# EAGLE design DCF77-Uhr-V4.1Big.OHW7 (EAGLE 6.4)

## Sheet 1 of 2
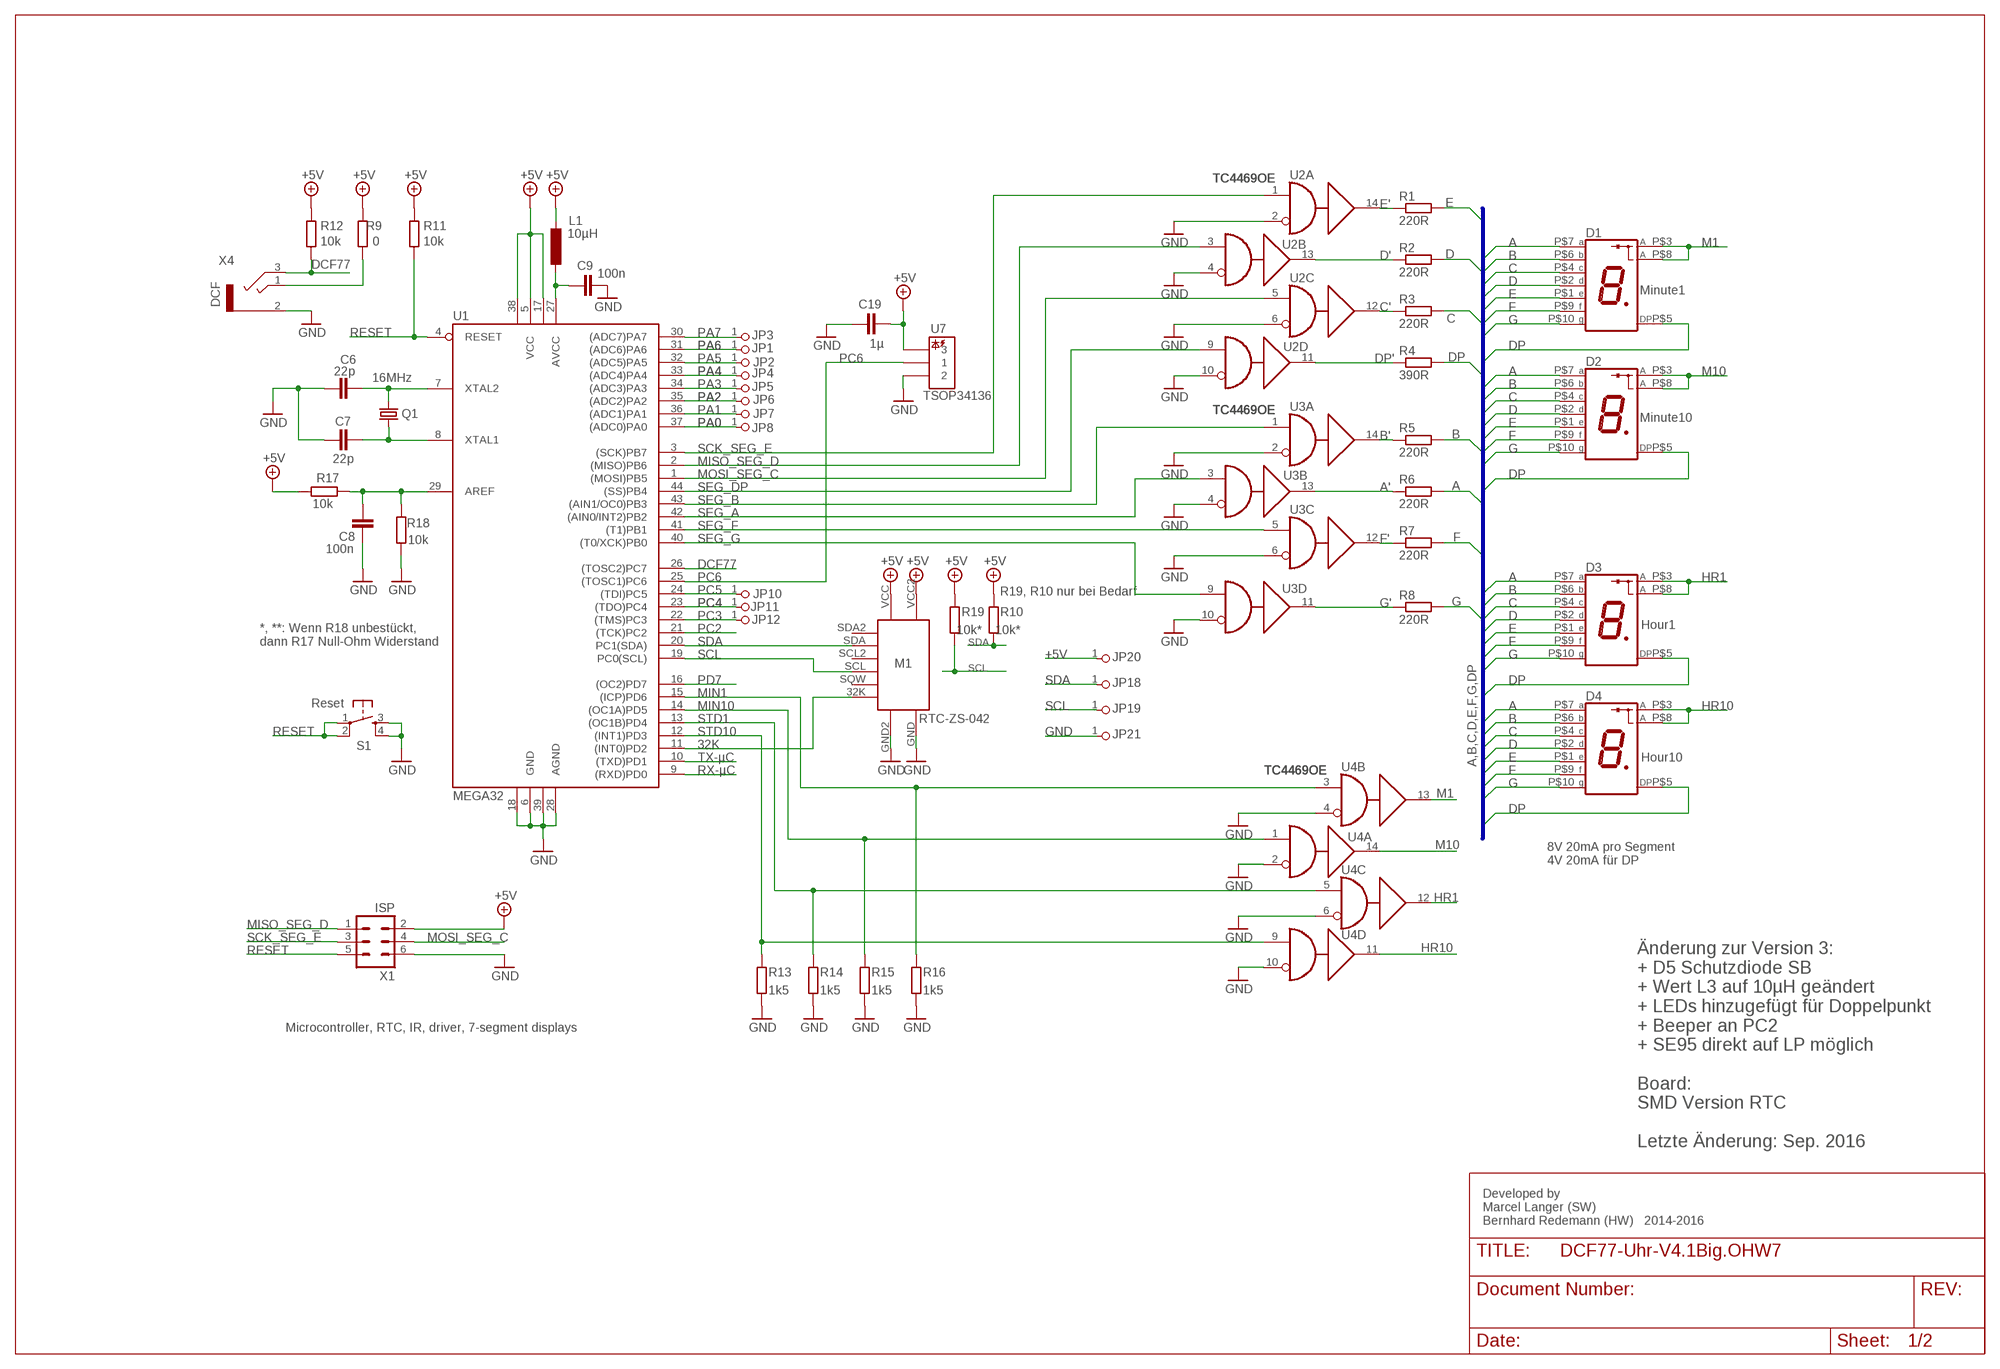
[diagram p0: schematic, sheet 1]

### Parts
C6  22p  C-EUC0805  [C0805]
C7  22p  C-EUC0805  [C0805]
C8  100n  C-EUC0805  [C0805]
C9  100n  C-EUC0805  [C0805]
C19  1µ  C-EUC0805  [C0805]
D1  Minute1  SA40-19EWA  [SA40-19EWA]
D2  Minute10  SA40-19EWA  [SA40-19EWA]
D3  Hour1  SA40-19EWA  [SA40-19EWA]
D4  Hour10  SA40-19EWA  [SA40-19EWA]
JP1  PA6  PINHD-1X1  [1X01]
JP2  PC5  PINHD-1X1  [1X01]
JP3  PA6  PINHD-1X1  [1X01]
JP4  PA4  PINHD-1X1  [1X01]
JP5  PA3  PINHD-1X1  [1X01]
JP6  PA2  PINHD-1X1  [1X01]
JP7  PA1  PINHD-1X1  [1X01]
JP8  PA0  PINHD-1X1  [1X01]
JP10  PC5  PINHD-1X1  [1X01]
JP11  PC4  PINHD-1X1  [1X01]
JP12  PC3  PINHD-1X1  [1X01]
JP18  SDA  PINHD-1X1  [1X01]
JP19  SCL  PINHD-1X1  [1X01]
JP20  +5V  PINHD-1X1  [1X01]
JP21  GND  PINHD-1X1  [1X01]
L1  10µH  L-EUL2825P  [L2825P]
M1  RTC-ZS-042  RTC-ZS-042SMD  [ZS-042-SMD]
Q1  16MHz  CRYSTALHC49UP  [HC49UP]
R1  220R  R-EU_M0805  [M0805]
R2  220R  R-EU_M0805  [M0805]
R3  220R  R-EU_M0805  [M0805]
R4  390R  R-EU_M0805  [M0805]
R5  220R  R-EU_M0805  [M0805]
R6  220R  R-EU_M0805  [M0805]
R7  220R  R-EU_M0805  [M0805]
R8  220R  R-EU_M0805  [M0805]
R9  0  R-EU_M0805  [M0805]
R10  10k*  R-EU_M0805  [M0805]
R11  10k  R-EU_M0805  [M0805]
R12  10k  R-EU_M0805  [M0805]
R13  1k5  R-EU_M0805  [M0805]
R14  1k5  R-EU_M0805  [M0805]
R15  1k5  R-EU_M0805  [M0805]
R16  1k5  R-EU_M0805  [M0805]
R17  10k  R-EU_M0805  [M0805]
R18  10k  R-EU_M0805  [M0805]
R19  10k*  R-EU_M0805  [M0805]
S1  Reset  DTSM-6  [DTSM-6]
U1  MEGA32  MEGA32-A  [TQFP44]
U2  TC4469OE  [SO-16DW]
U3  TC4469OE  [SO-16DW]
U4  TC4469OE  [SO-16DW]
U7  TSOP34136  [TSOP348]
X1  ISP  ML6  [ML6]
X4  DCF  1502_01  [1502_01]

### Nets
32K: M1.32K U1.11((INT0)PD2)
+5V: C19.2 JP20.1 L1.2 M1.VCC M1.VCC2 R9.2 R10.2 R11.2 R12.2 R17.1 R19.2 U1.5(VCC) U1.17(VCC1) U1.38(VCC2) U7.3 X1.2 ; also sheet 2
A: D1.P$7(A) D2.P$7(A) D3.P$7(A) D4.P$7(A) R6.2
A': R6.1 U3.13(B:Y)
AREF: C8.2 R17.2 R18.2 U1.29(AREF)
B: D1.P$6(B) D2.P$6(B) D3.P$6(B) D4.P$6(B) R5.2
B': R5.1 U3.14(A:Y)
C: D1.P$4(C) D2.P$4(C) D3.P$4(C) D4.P$4(C) R3.2
C': R3.1 U2.12(C:Y)
D: D1.P$2(D) D2.P$2(D) D3.P$2(D) D4.P$2(D) R2.2
D': R2.1 U2.13(B:Y)
DCF77: R12.1 U1.26((TOSC2)PC7) X4.3
DP: D1.P$5(DP) D2.P$5(DP) D3.P$5(DP) D4.P$5(DP) R4.2
DP': R4.1 U2.11(D:Y)
E: D1.P$1(E) D2.P$1(E) D3.P$1(E) D4.P$1(E) R1.2
E': R1.1 U2.14(A:Y)
F: D1.P$9(F) D2.P$9(F) D3.P$9(F) D4.P$9(F) R7.2
F': R7.1 U3.12(C:Y)
G: D1.P$10(G) D2.P$10(G) D3.P$10(G) D4.P$10(G) R8.2
G': R8.1 U3.11(D:Y)
GND: C6.1 C7.1 C8.1 C9.2 C19.1 JP21.1 M1.GND M1.GND2 R13.1 R14.1 R15.1 R16.1 R18.1 S1.3 S1.4 U1.6(GND) U1.18(GND1) U1.28(AGND) U1.39(GND2) U2.2(A:B) U2.4(B:B) U2.6(C:B) U2.10(D:B) U3.2(A:B) U3.4(B:B) U3.6(C:B) U3.10(D:B) U4.2(A:B) U4.4(B:B) U4.6(C:B) U4.10(D:B) U7.2 X1.6 X4.2 ; also sheet 2
HR1: D3.P$3(A) D3.P$8(A) U4.12(C:Y)
HR10: D4.P$3(A) D4.P$8(A) U4.11(D:Y)
M1: D1.P$3(A) D1.P$8(A) U4.13(B:Y)
M10: D2.P$3(A) D2.P$8(A) U4.14(A:Y)
MIN1: R16.2 U1.15((ICP)PD6) U4.3(B:A)
MIN10: R15.2 U1.14((OC1A)PD5) U4.1(A:A)
MISO_SEG_D: U1.2((MISO)PB6) U2.3(B:A) X1.1
MOSI_SEG_C: U1.1((MOSI)PB5) U2.5(C:A) X1.4
N$1: C6.2 Q1.2 U1.7(XTAL2)
N$2: C7.2 Q1.1 U1.8(XTAL1)
N$3: R9.1 X4.1
N$11: C9.1 L1.1 U1.27(AVCC)
PA0: JP8.1 U1.37((ADC0)PA0)
PA1: JP7.1 U1.36((ADC1)PA1)
PA2: JP6.1 U1.35((ADC2)PA2)
PA3: JP5.1 U1.34((ADC3)PA3)
PA4: JP4.1 U1.33((ADC4)PA4)
PA5: JP2.1 U1.32((ADC5)PA5)
PA6: JP1.1 U1.31((ADC6)PA6)
PA7: JP3.1 U1.30((ADC7)PA7)
PC2: U1.21((TCK)PC2) ; also sheet 2
PC3: JP12.1 U1.22((TMS)PC3)
PC4: JP11.1 U1.23((TDO)PC4)
PC5: JP10.1 U1.24((TDI)PC5)
PC6: U1.25((TOSC1)PC6) U7.1
PD7: U1.16((OC2)PD7) ; also sheet 2
RESET: R11.1 S1.1 S1.2 U1.4(RESET) X1.5
RX-µC: U1.9((RXD)PD0) ; also sheet 2
SCK_SEG_E: U1.3((SCK)PB7) U2.1(A:A) X1.3
SCL: JP19.1 M1.SCL R19.1 U1.19(PC0(SCL)) ; also sheet 2
SDA: JP18.1 M1.SDA R10.1 U1.20(PC1(SDA)) ; also sheet 2
SEG_A: U1.42((AIN0/INT2)PB2) U3.3(B:A)
SEG_B: U1.43((AIN1/OC0)PB3) U3.1(A:A)
SEG_DP: U1.44((SS)PB4) U2.9(D:A)
SEG_F: U1.41((T1)PB1) U3.5(C:A)
SEG_G: U1.40((T0/XCK)PB0) U3.9(D:A)
STD1: R14.2 U1.13((OC1B)PD4) U4.5(C:A)
STD10: R13.2 U1.12((INT1)PD3) U4.9(D:A)
TX-µC: U1.10((TXD)PD1) ; also sheet 2
Unconnected: M1.SCL2 M1.SDA2 M1.SQW

### Buses
A,B,C,D,E,F,G,DP

### Notes on the sheet
- R19, R10 nur bei Bedarf
- *, **: Wenn R18 unbestückt,
  dann R17 Null-Ohm Widerstand
- 8V 20mA pro Segment
  4V 20mA für DP
- Microcontroller, RTC, IR, driver, 7-segment displays
- Änderung zur Version 3:
  + D5 Schutzdiode SB
  + Wert L3 auf 10µH geändert
  + LEDs hinzugefügt für Doppelpunkt
  + Beeper an PC2
  + SE95 direkt auf LP möglich
  
  Board:
  SMD Version RTC
- Letzte Änderung: Sep. 2016
- Developed by 
  Marcel Langer (SW)
  Bernhard Redemann (HW)   2014-2016

## Sheet 2 of 2
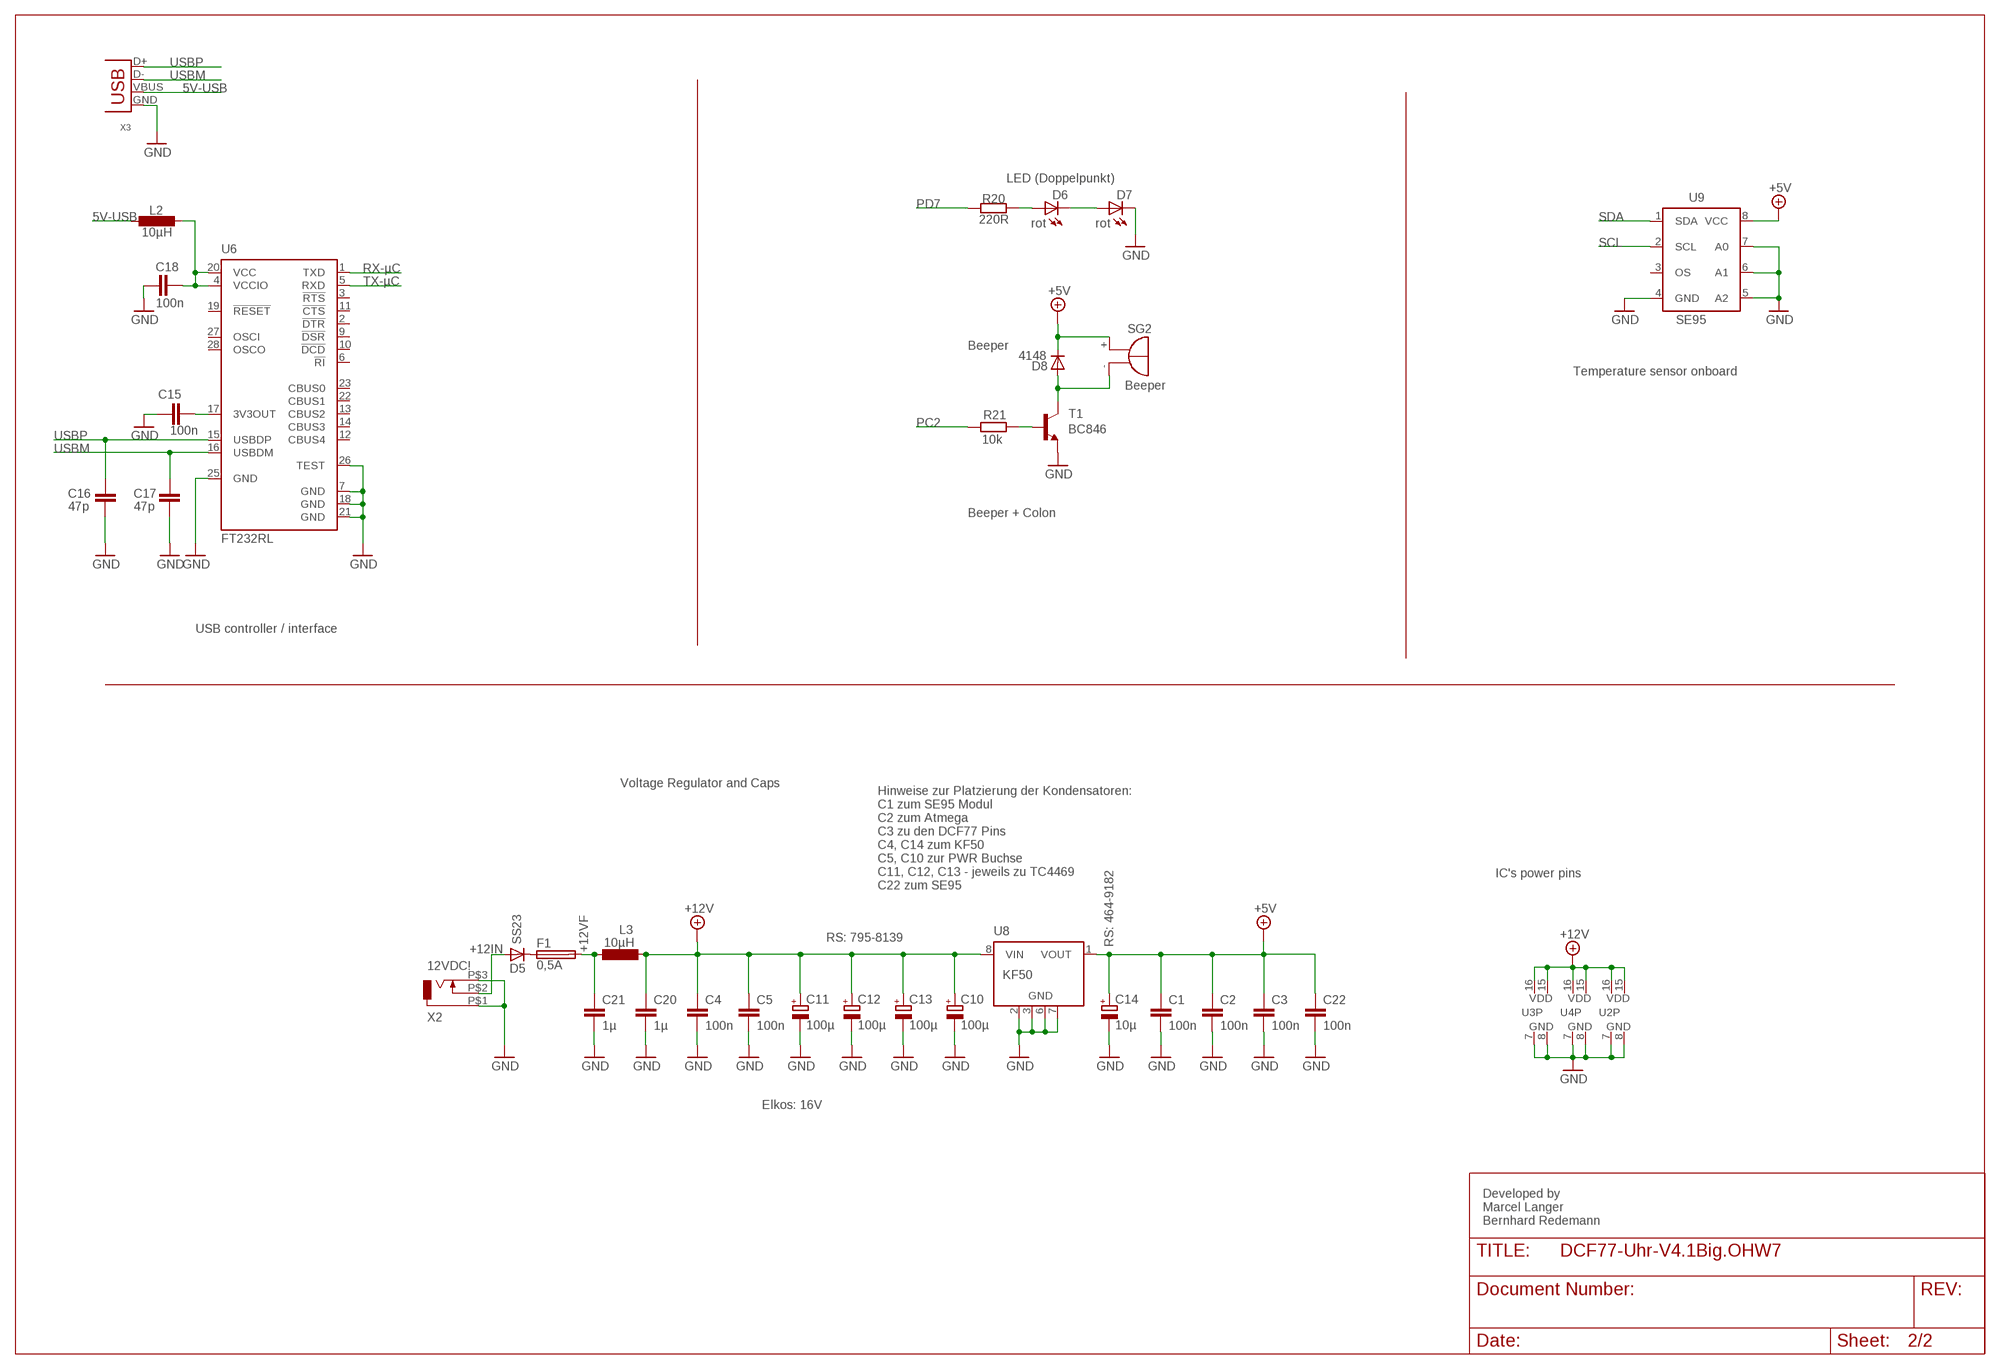
[diagram p1: schematic, sheet 2]

### Parts
C1  100n  C-EUC0805  [C0805]
C2  100n  C-EUC0805  [C0805]
C3  100n  C-EUC0805  [C0805]
C4  100n  C-EUC0805  [C0805]
C5  100n  C-EUC0805  [C0805]
C10  100µ  CPOL-EUD  [PANASONIC_D]
C11  100µ  CPOL-EUD  [PANASONIC_D]
C12  100µ  CPOL-EUD  [PANASONIC_D]
C13  100µ  CPOL-EUD  [PANASONIC_D]
C14  10µ  CPOL-EUB  [PANASONIC_B]
C15  100n  C-EUC0805  [C0805]
C16  47p  C-EUC0805  [C0805]
C17  47p  C-EUC0805  [C0805]
C18  100n  C-EUC0805  [C0805]
C20  1µ  C-EUC0805  [C0805]
C21  1µ  C-EUC0805  [C0805]
C22  100n  C-EUC0805  [C0805]
D5  SS23  DIODE-SMB  [SMB]
D6  rot  LED10MM  [LED10MM]
D7  rot  LED10MM  [LED10MM]
D8  4148  DIODE-DO214BA  [DO214BA]
F1  0,5A  19560  [19560]
L2  10µH  L-EUL2825P  [L2825P]
L3  10µH  L-EUL2825P  [L2825P]
R20  220R  R-EU_M0805  [M0805]
R21  10k  R-EU_M0805  [M0805]
SG2  Beeper  BMT1205XH7.5  [BMT1205XH7.5]
T1  BC846  [SOT23]
U6  FT232RL  [SSOP28]
U8  KF50  78L05SMD  [SO08]
U9  SE95  LM75SMD  [SO08]
X2  12VDC!  DCJ0202DCJ04-021  [DCJ04-021]
X3  USB  USB-B180  [USB-B180]

### Nets
5V-USB: L2.2 X3.VBUS
+5V: C1.1 C2.1 C3.1 C14.+ C22.1 D8.C SG2.+ U8.1(VOUT) U9.8(VCC) ; also sheet 1
+12IN: D5.A X2.P$2
+12V: C4.1 C5.1 C10.+ C11.+ C12.+ C13.+ C20.1 L3.1 U2.15(P:VDD) U2.16(P:VDD) U3.15(P:VDD) U3.16(P:VDD) U4.15(P:VDD) U4.16(P:VDD) U8.8(VIN)
+12VF: C21.1 F1.2 L3.2
GND: C1.2 C2.2 C3.2 C4.2 C5.2 C10.- C11.- C12.- C13.- C14.- C15.1 C16.1 C17.1 C18.1 C20.2 C21.2 C22.2 D7.K(C) T1.2(E) U2.7(P:GND) U2.8(P:GND) U3.7(P:GND) U3.8(P:GND) U4.7(P:GND) U4.8(P:GND) U6.7(GND) U6.18(GND) U6.21(GND) U6.25(GND) U6.26(TEST) U8.2(GND) U8.3(GND) U8.6(GND) U8.7(GND) U9.4(GND) U9.5(A2) U9.6(A1) U9.7(A0) X2.P$1 X2.P$3 X3.GND ; also sheet 1
N$4: D5.C F1.1
N$5: D6.A R20.2
N$6: D6.K(C) D7.A
N$7: R21.1 T1.1(B)
N$8: D8.A SG2.- T1.3(C)
N$12: C15.2 U6.17(3V3OUT)
N$16: C18.2 L2.1 U6.4(VCCIO) U6.20(VCC)
PC2: R21.2 ; also sheet 1
PD7: R20.1 ; also sheet 1
RX-µC: U6.1(TXD) ; also sheet 1
SCL: U9.2(SCL) ; also sheet 1
SDA: U9.1(SDA) ; also sheet 1
TX-µC: U6.5(RXD) ; also sheet 1
USBM: C17.2 U6.16(USBDM) X3.D-
USBP: C16.2 U6.15(USBDP) X3.D+
Unconnected: U6.2(!DTR) U6.3(!RTS) U6.6(!RI) U6.9(!DSR) U6.10(!DCD) U6.11(!CTS) U6.12(CBUS4) U6.13(CBUS2) U6.14(CBUS3) U6.19(!RESET) U6.22(CBUS1) U6.23(CBUS0) U6.27(OSCI) U6.28(OSCO) U8.4(NC) U8.5(NC) U9.3(OS)

### Notes on the sheet
- LED (Doppelpunkt)
- Beeper
- Temperature sensor onboard
- Beeper + Colon
- USB controller / interface
- Voltage Regulator and Caps
- IC's power pins
- Hinweise zur Platzierung der Kondensatoren:
  C1 zum SE95 Modul
  C2 zum Atmega
  C3 zu den DCF77 Pins
  C4, C14 zum KF50
  C5, C10 zur PWR Buchse
  C11, C12, C13 - jeweils zu TC4469
  C22 zum SE95
- RS: 795-8139
- RS: 464-9182
- Elkos: 16V
- Developed by 
  Marcel Langer
  Bernhard Redemann

## Library data of the parts
C1-C9 C15-C22 = rcl:C-EU: CAPACITOR, European symbol
C10-C14 = rcl:CPOL-EU: POLARIZED CAPACITOR, European symbol
D1-D4 = led-7-segment:SA40-19EWA
D5 D8 = diode:DIODE-: DIODE
D6 D7 = led:LED: LED OSRAM: - CHIPLED LG R971, LG N971, LY N971, LG Q971, LY Q971, LO R971, LY R971 LH N974, LH R974 LS Q976, LO Q976, LY Q976 LO Q996 - Hyper CHIPLED LW Q18S LB Q993, LB Q99A, LB R99A - SideLED LS A670, LO A670, LY A670, LG A670, LP A670 LB A673, LV A673, LT A673, LW A673 LH A674 LY A675 LS A676, LA A676, LO A676, LY A676, LW A676 LS A679, LY A679, LG A679 - Hyper Micro SIDELED® LS Y876, LA Y876, LO Y876, LY Y876 LT Y87S - SmartLED LW L88C, LW L88S LB L89C, LB L89S, LG L890 LS L89K, LO L89K, LY L89K LS L896, LA L896, LO L896, LY L896 - TOPLED LS T670, LO T670, LY T670, LG T670, LP T670 LSG T670, LSP T670, LSY T670, LOP T670, LYG T670 LG T671, LOG T671, LSG T671 LB T673, LV T673, LT T673, LW T673 LH T674 LS T676, LA T676, LO T676, LY T676, LB T676, LH T676, LSB T676, LW T676 LB T67C, LV T67C, LT T67C, LS T67K, LO T67K, LY T67K, LW E67C LS E67B, LA E67B, LO E67B, LY E67B, LB E67C, LV E67C, LT E67C LW T67C LS T679, LY T679, LG T679 LS T770, LO T770, LY T770, LG T770, LP T770 LB T773, LV T773, LT T773, LW T773 LH T774 LS E675, LA E675, LY E675, LS T675 LS T776, LA T776, LO T776, LY T776, LB T776 LHGB T686 LT T68C, LB T68C - Hyper Mini TOPLED® LB M676 - Mini TOPLED Santana® LG M470 LS M47K, LO M47K, LY M47K Source: http://www.osram.convergy.de LUXEON: - LUMILED® LXK2-PW12-R00, LXK2-PW12-S00, LXK2-PW14-U00, LXK2-PW14-V00 LXK2-PM12-R00, LXK2-PM12-S00, LXK2-PM14-U00 LXK2-PE12-Q00, LXK2-PE12-R00, LXK2-PE12-S00, LXK2-PE14-T00, LXK2-PE14-U00 LXK2-PB12-K00, LXK2-PB12-L00, LXK2-PB12-M00, LXK2-PB14-N00, LXK2-PB14-P00, LXK2-PB14-Q00 LXK2-PR12-L00, LXK2-PR12-M00, LXK2-PR14-Q00, LXK2-PR14-R00 LXK2-PD12-Q00, LXK2-PD12-R00, LXK2-PD12-S00 LXK2-PH12-R00, LXK2-PH12-S00 LXK2-PL12-P00, LXK2-PL12-Q00, LXK2-PL12-R00 Source: www.luxeon.com KINGBRIGHT: KA-3528ASYC Source: www.kingbright.com
F1 = fuse:19560: FUSE HOLDER TR5, Wickmann; MPN: 56000001009; OC_FARNELL: 1185363; OC_NEWARK: 15P8392
JP1-JP8 JP10-JP12 JP18-JP21 = pinhead:PINHD-1X1: PIN HEADER
L1-L3 = rcl:L-EU: INDUCTOR, European symbol
M1 = module-diverse:RTC-ZS-042
Q1 = crystal:CRYSTAL: CRYSTAL; OC_FARNELL: unknown; OC_NEWARK: unknown
R1-R21 = rcl:R-EU_: RESISTOR, European symbol
S1 = switch-tact:DTSM-6
SG2 = buzzer:BMT1205XH7.5: MAGNETIC TRANSDUCER Source: Http:www.be-star.com; OC_FARNELL: unknown; OC_NEWARK: unknown
T1 = transistor:BC846: NPN TRANSISTOR
U1 = atmel:MEGA32: MICROCONTROLLER 32 Kbytes FLASH 2 Kbytes SRAM 1 Kbytes EEPROM USART 8-channel 10 bit ADC
U2-U4 = microchip:TC4469OE: Logic-Input CMOS Quad Drivers Source: TC 4469-MOSFET-DRIVER.pdf; MF: MICROCHIP; MPN: TC4469COE; OC_FARNELL: 1292288; OC_NEWARK: 92C6158
U6 = ftdichip:FT232R: Source: http://www.ftdichip.com/Documents/DataSheets/DS_FT232R_v104.pdf; MPN: FT232RL; OC_FARNELL: 1146032; OC_NEWARK: 91K9918
U7 = vishay-1:TSOP34136
U8 = linear:78L*SMD: Positive VOLTAGE REGULATOR
U9 = national-semiconductor:LM75
X1 = con-harting-ml:ML6: HARTING; OC_FARNELL: unknown; OC_NEWARK: unknown
X2 = con-jack:DCJ0202: DC POWER JACK Source: DCJ0202.pdf
X3 = con-usb-3:USB: USB Connectors
X4 = con-lumberg:1502_01: Jack connectors according to JISC 6560, 3.5 mm Klinkensteckverbinder nach JISC 6560, 3,5 mm Source: http://www.lumberg.com/Produkte/PDFs/1502_01.pdf; OC_FARNELL: 4739747; OC_NEWARK: unknown

## Board
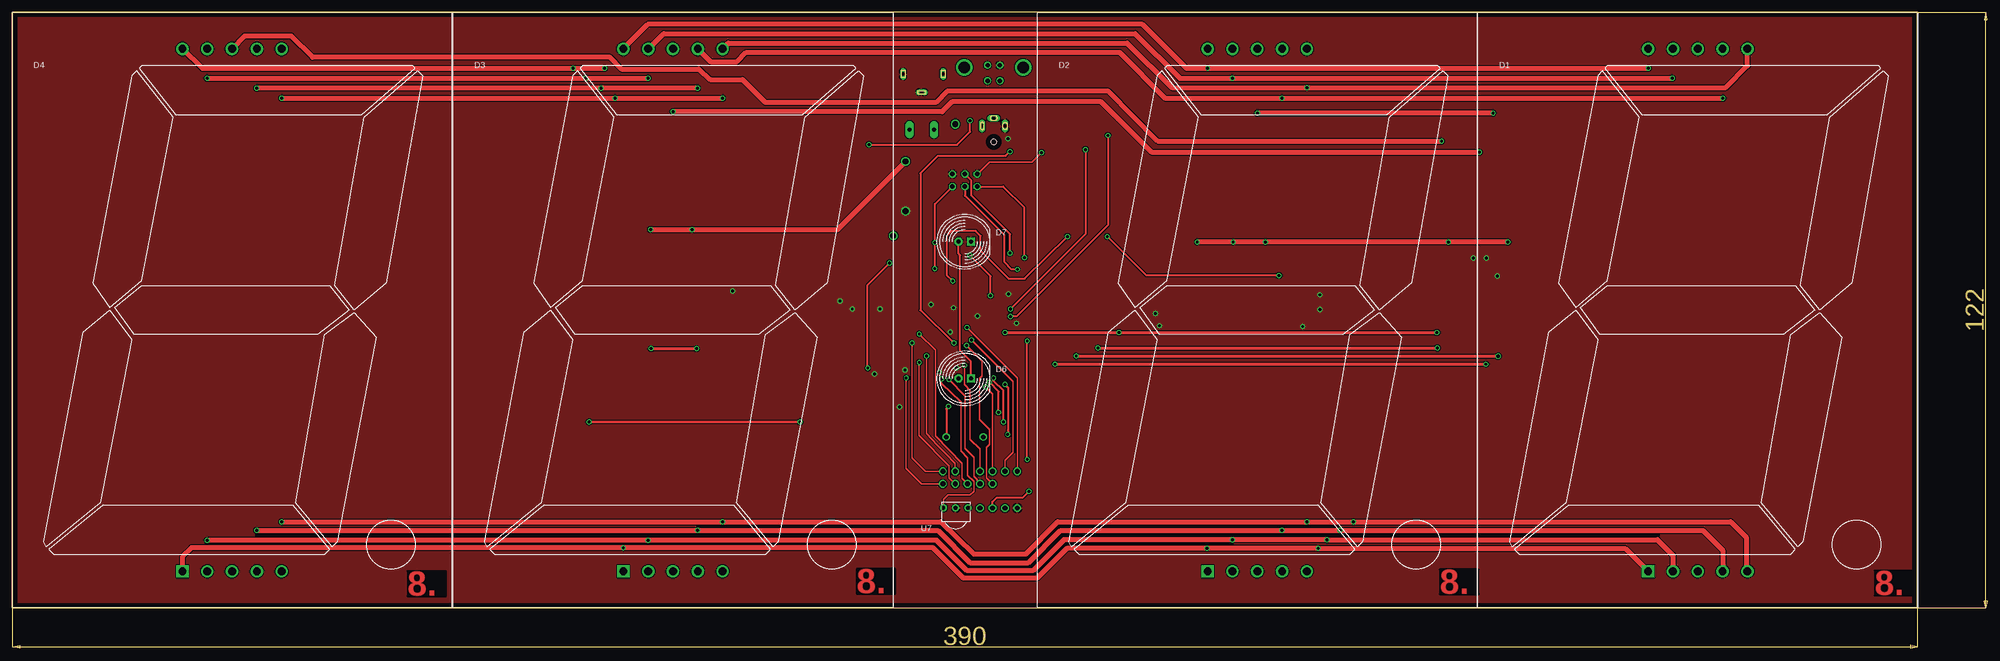
[diagram p2: board, top side]
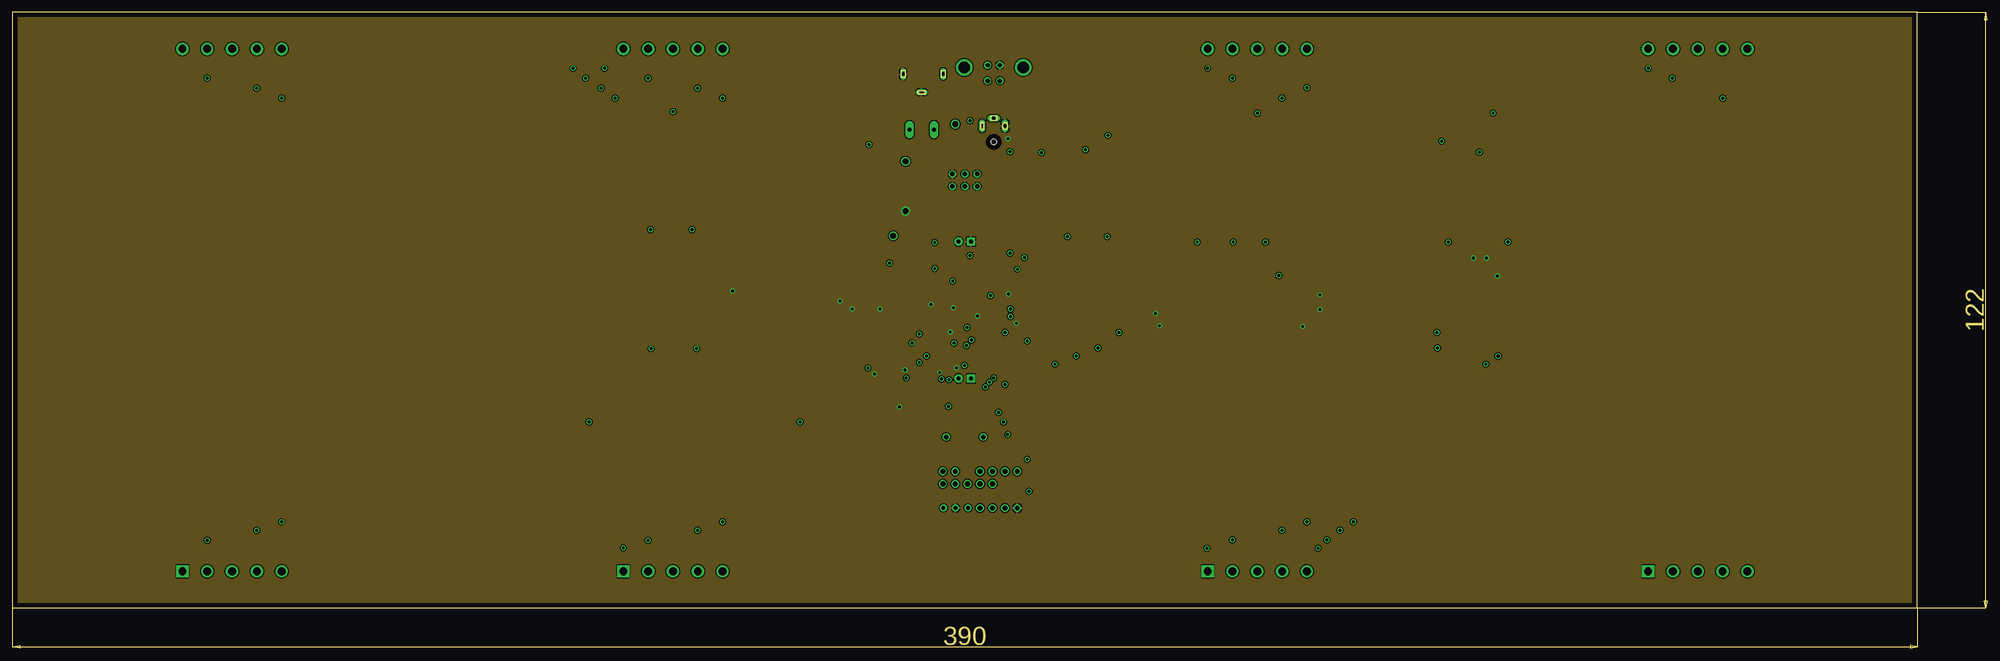
[diagram p3: board, inner layer Route2]
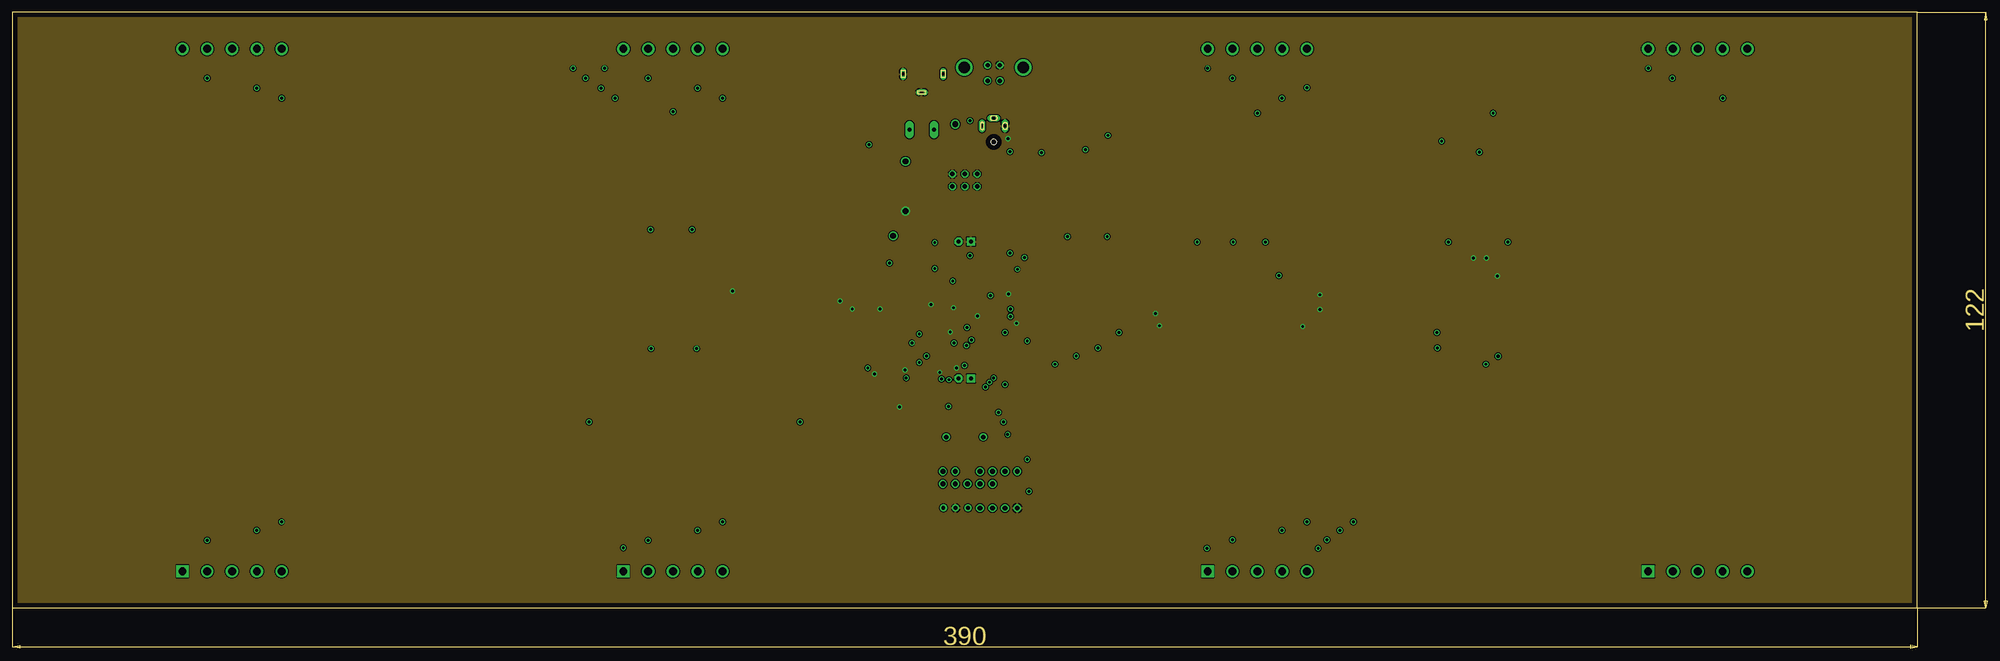
[diagram p4: board, inner layer Route3]
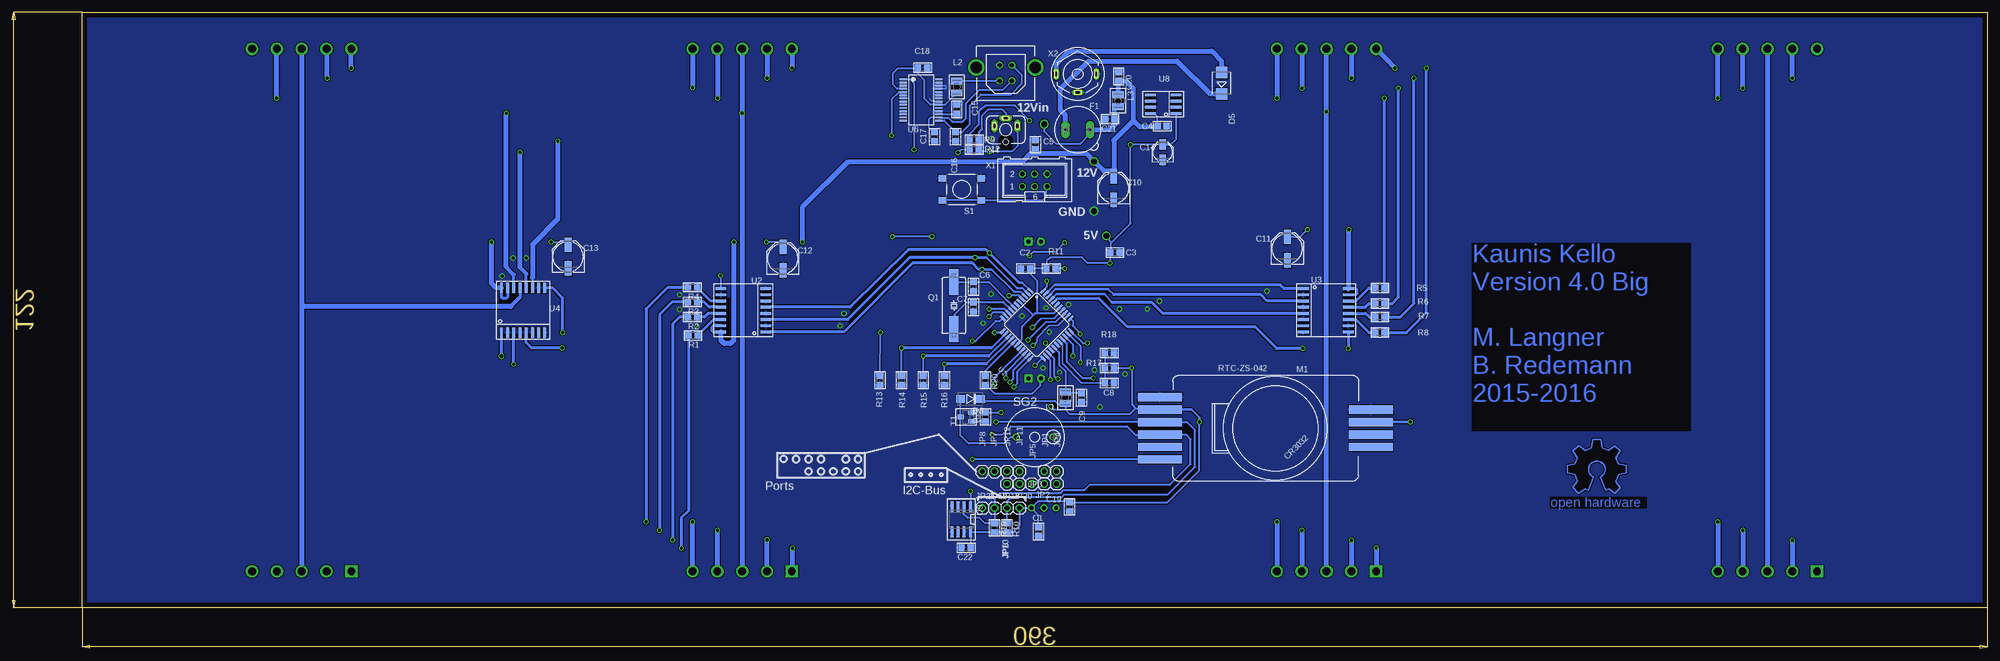
[diagram p5: board, bottom side, seen from below]

Size 390 x 122 mm. Coordinates in mm from the lower left corner, seen from the top.
Outline: 0,0 390,0 390,122 0,122 0,0
Copper layers (1*16): Top 0.035mm / dielectric 1.5mm / Bottom 0.035mm
Design rules "default *": minimum track width 10mil, minimum drill 0.5mm, track to track 8mil, track to pad 8mil, pad to pad 8mil, via to via 8mil, smd to smd 8mil, copper to edge 40mil, drill to drill 8mil, minimum pad ring 10mil, minimum via ring 8mil, stop-mask expansion 4mil, vias tented up to drill 0mil, thermal gap 10mil
tRestrict: area 49.8,14.7 to 50.5,15.1; area 336.4,14.9 to 337.3,15
bRestrict: area 209.6,106.3 to 212.3,107.1; area 187.3,42.7 to 190.1,43.4; area 214.4,106.5 to 214.9,106.7; area 176.5,103.5 to 179.3,104.3; area 214.4,103.9 to 214.9,104.1; area 214.4,103.3 to 214.9,103.5; area 214.4,102 to 214.9,102.1; area 214.4,101.4 to 214.9,101.5; area 221.6,104.6 to 222.1,104.7; area 221.6,104 to 222.1,104.1; area 257.3,62.4 to 257.9,63.5; area 170.9,104.1 to 171.7,104.6; area 170.9,101.7 to 171.7,102.2; area 170.9,102.8 to 171.7,103.5; area 165.7,101.7 to 166.5,102.2; area 165.7,102.8 to 166.5,103.5; area 165.7,104.1 to 166.5,104.6; area 211.1,20.3 to 211.6,21.2; area 211,15.1 to 211.6,16; area 209.7,15.1 to 210.4,16; area 139.6,58.1 to 140.5,58.7; area 139.6,56.8 to 140.5,57.5; area 249.6,63.2 to 250.4,63.8; area 249.6,64.5 to 250.4,65.1; area 295.6,55.9 to 296.2,56.8; area 296.9,55.9 to 297.5,56.8; area 303.2,62.5 to 304.7,62.9; area 304.4,62.9 to 304.7,63.2; area 232.5,60.7 to 232.7,61

### Footprints (pad centres in the part's own frame; a part is rotated, then mirrored left to right if it is on the bottom)
C0805 = smd 1.3 x 1.5: 1 -0.95,0; 2 0.95,0
PANASONIC_D = smd 3 x 1.4: + 2.4,0; - -2.4,0
PANASONIC_B = smd 2.2 x 1.4: + 1.6,0; - -1.6,0
SA40-19EWA = drill 1.6 pad 2.54 square: P$1 -10.16,-53.5 | drill 1.6 pad 2.54: P$2 -5.08,-53.5; P$3 0,-53.5; P$4 5.08,-53.5; P$5 10.16,-53.5; P$6 10.16,53.5; P$7 5.08,53.5; P$8 0,53.5; P$9 -5.08,53.5; P$10 -10.16,53.5
SMB = smd 2.4 x 2.4: A 2.2,0; C -2.2,0
LED10MM = drill 0.813 pad 1.676 octagon: A -1.27,0 | drill 0.813 pad 1.676 square: K 1.27,0
DO214BA = smd 1.8 x 1.7: A 2.05,0; C -2.05,0
19560 = drill 0.813 pad 1.778 long: 1 -2.54,0; 2 2.54,0
1X01 = drill 1 pad 1.6: 1 0,0
L2825P = smd 1.4 x 2.4: 1 -1.2,0; 2 1.2,0
ZS-042-SMD = smd 9 x 1.7: 32K -24.13,-6.35; GND -24.13,6.35; GND2 19.05,3.81; SCL -24.13,-1.27; SCL2 19.05,-3.81; SDA -24.13,1.27; SDA2 19.05,-1.27; SQW -24.13,-3.81; VCC -24.13,3.81; VCC2 19.05,1.27
HC49UP = smd 5.334 x 1.93: 1 -4.826,0; 2 4.826,0
M0805 = smd 1.3 x 1.6: 1 -0.95,0; 2 0.95,0
DTSM-6 = smd 1.55 x 1.3: 1 -3.975,2.25; 2 3.975,2.25; 3 -3.975,-2.25; 4 3.975,-2.25
BMT1205XH7.5 = drill 0.9 pad 1.5: + 3.8,0; - -3.8,0
SOT23 = smd 1 x 1.4: 1 -0.95,-1.1; 2 0.95,-1.1; 3 0,1.1
TQFP44 = smd 1.5 x 0.5: 1 -5.8,4; 2 -5.8,3.2; 3 -5.8,2.4; 4 -5.8,1.6; 5 -5.8,0.8; 6 -5.8,0; 7 -5.8,-0.8; 8 -5.8,-1.6; 9 -5.8,-2.4; 10 -5.8,-3.2; 11 -5.8,-4; 23 5.8,-4; 24 5.8,-3.2; 25 5.8,-2.4; 26 5.8,-1.6; 27 5.8,-0.8; 28 5.8,0; 29 5.8,0.8; 30 5.8,1.6; 31 5.8,2.4; 32 5.8,3.2; 33 5.8,4 | smd 0.5 x 1.5: 12 -4,-5.8; 13 -3.2,-5.8; 14 -2.4,-5.8; 15 -1.6,-5.8; 16 -0.8,-5.8; 17 0,-5.8; 18 0.8,-5.8; 19 1.6,-5.8; 20 2.4,-5.8; 21 3.2,-5.8; 22 4,-5.8; 34 4,5.8; 35 3.2,5.8; 36 2.4,5.8; 37 1.6,5.8; 38 0.8,5.8; 39 0,5.8; 40 -0.8,5.8; 41 -1.6,5.8; 42 -2.4,5.8; 43 -3.2,5.8; 44 -4,5.8
SO-16DW = smd 0.6 x 2.2: 1 -4.445,-4.6; 2 -3.175,-4.6; 3 -1.905,-4.6; 4 -0.635,-4.6; 5 0.635,-4.6; 6 1.905,-4.6; 7 3.175,-4.6; 8 4.445,-4.6; 9 4.445,4.6; 10 3.175,4.6; 11 1.905,4.6; 12 0.635,4.6; 13 -0.635,4.6; 14 -1.905,4.6; 15 -3.175,4.6; 16 -4.445,4.6
SSOP28 = smd 0.4 x 1.5: 1 -4.225,-3.625; 2 -3.575,-3.625; 3 -2.925,-3.625; 4 -2.275,-3.625; 5 -1.625,-3.625; 6 -0.975,-3.625; 7 -0.325,-3.625; 8 0.325,-3.625; 9 0.975,-3.625; 10 1.625,-3.625; 11 2.275,-3.625; 12 2.925,-3.625; 13 3.575,-3.625; 14 4.225,-3.625; 15 4.225,3.625; 16 3.575,3.625; 17 2.925,3.625; 18 2.275,3.625; 19 1.625,3.625; 20 0.975,3.625; 21 0.325,3.625; 22 -0.325,3.625; 23 -0.975,3.625; 24 -1.625,3.625; 25 -2.275,3.625; 26 -2.925,3.625; 27 -3.575,3.625; 28 -4.225,3.625
TSOP348 = drill 0.8 pad 1.422: 1 -2.54,0; 2 0,0; 3 2.54,0
SO08 = smd 0.6 x 2.2: 1 -1.905,-2.6; 2 -0.635,-2.6; 3 0.635,-2.6; 4 1.905,-2.6; 5 1.905,2.6; 6 0.635,2.6; 7 -0.635,2.6; 8 -1.905,2.6
ML6 = drill 0.914 octagon: 1 -2.54,-1.27; 2 -2.54,1.27; 3 0,-1.27; 4 0,1.27; 5 2.54,-1.27; 6 2.54,1.27
DCJ04-021 = drill 0.7 long: P$1 0,3.8; P$2 0,-4.4; P$3 3.75,0
USB-B180 = drill 0.914: D+ -1.25,-1.8; D- -1.25,1.4; GND 1.25,-1.8; VBUS 1.25,1.4 | drill 2.4: P$2 -6.02,-1.34; P$3 6.02,-1.34
1502_01 = drill 0.8 pad 1.2 long: 1 0,2.35; 2 -2.35,0.75; 3 2.35,0.75 | hole 1.2: 0,-2.5

### Placement (x,y rotation side)
C1  194.19,15.62 270 bottom
C2  196.85,69.47 180 bottom
C3  178.56,72.77 0 bottom
C4  168.89,98.66 0 bottom
C5  194.87,94.89 90 bottom
C6  207.52,65.79 90 bottom
C7  207.52,61.59 90 bottom
C8  179.71,46.1 180 bottom
C9  185.42,43.05 270 bottom
C10  178.82,85.98 90 bottom
C11  143.28,73.62 90 bottom
C12  246.54,71.57 90 bottom
C13  290.48,71.94 90 bottom
C14  168.78,93.34 90 bottom
C15  210.95,102.11 270 bottom
C16  211.2,96.52 90 bottom
C17  215.52,96.52 90 bottom
C18  217.93,110.62 180 bottom
C19  187.83,20.7 90 bottom
C20  177.8,108.84 90 bottom
C21  179.58,100.08 180 bottom
C22  209.04,12.32 180 bottom
D1  345.04,61 0 top
D2  254.87,61 0 top
D3  135.25,61 0 top
D4  45,61 0 top
D5  156.72,107.44 90 bottom
D6  195,47 0 top
D7  195,75 0 top
D8  208.15,42.8 180 bottom
F1  186.18,97.95 0 bottom
JP1  193.04,27.94 0 bottom
JP2  193.04,25.4 0 bottom
JP3  190.5,25.4 0 bottom
JP4  190.5,27.94 90 bottom
JP5  195.58,25.4 90 bottom
JP6  200.66,25.4 90 bottom
JP7  203.2,27.94 90 bottom
JP8  205.74,27.94 90 bottom
JP10  198.12,25.4 90 bottom
JP11  198.12,27.94 90 bottom
JP12  200.66,27.94 90 bottom
JP18  200.66,20.45 0 bottom
JP19  203.2,20.45 0 bottom
JP20  198.12,20.45 0 bottom
JP21  205.74,20.45 0 bottom
L1  188.72,43.05 270 bottom
L2  210.95,106.68 90 bottom
L3  177.93,103.89 270 bottom
M1  145.21,36.77 0 bottom
Q1  211.54,61.91 90 bottom
R1  264.94,55.83 180 bottom
R2  265.05,59.56 180 bottom
R3  265.05,62.61 180 bottom
R4  265.05,65.66 180 bottom
R5  124.33,65.53 0 bottom
R6  124.33,62.36 0 bottom
R7  124.33,59.56 0 bottom
R8  124.33,56.39 0 bottom
R9  207.39,95.89 180 bottom
R10  200.66,16.38 270 bottom
R11  191.64,69.47 180 bottom
R12  207.39,93.85 180 bottom
R13  226.69,46.61 90 bottom
R14  222.25,46.61 90 bottom
R15  217.81,46.61 90 bottom
R16  213.49,46.61 90 bottom
R17  179.71,49.15 180 bottom
R18  179.71,52.2 180 bottom
R19  203.2,16.38 270 bottom
R20  205.1,46.61 270 bottom
R21  205.1,39.12 90 bottom
S1  209.93,85.72 180 bottom
SG2  195,35 0 bottom
T1  209.04,39.12 90 bottom
U1  194.55,58.02 315 bottom
U2  254.63,60.96 90 bottom
U3  135.38,60.96 270 bottom
U4  299.72,60.96 0 bottom
U6  218.25,104.03 270 bottom
U7  193.14,20.45 0 top
U8  168.71,103.16 90 bottom
U9  210.06,18.16 180 bottom
U$1  [OPEN_HARDWARE]  79.88,28.19 0 bottom
X1  195,87.59 0 bottom
X2  186.18,109.35 270 bottom
X3  200.91,109.35 180 bottom
X4  200.91,97.95 0 bottom

### Tracks (layer width: path | path; a pad name or v marks a point on that pad's centre or on a via)
5V-USB
  Bottom 0.305: 210.68,107.95 L2.2
  Bottom 0.406: 210.68,107.95 202.67,107.95 X3.VBUS
32K  (via drill 0.6)
  Top 0.406: v207.78,30.4 v207.77,54.66
  Bottom 0.406: v207.77,54.66 207.09,54.66 202.95,58.8 202.06,58.8 201.56,59.29 U1.11 | M1.32K 201.24,30.43 v207.78,30.4
+5V  (via drill 0.6, 0.6 pad 0.61, 1.2 pad 1.78)
  Top 0.305: v210.69,93.22 208.79,91.31 200.03,91.31 197.57,88.86 X1.2
  Top 0.406: v175.13,49.15 175.13,66.17 v179.58,70.61 | v175.39,94.87 193.42,94.87 196.09,97.54 v196.09,99.82 | v191.64,41.27 191.24,40.75 191.24,35.28 191.26,34.92 191.26,35.06 SG2.+
  Top 0.5: v118.11,38.1 v161.29,38.1
  Bottom 0.305: v210.69,93.22 210.06,93.85 R12.2
  Bottom 0.406: 188.72,42.16 L1.2 | 189.85,61.59 189.98,61.46 191.13,60.33 194.56,60.33 | 194.56,60.33 194.94,60.33 195.26,60.01 | 194.56,60.33 194.56,67.06 195.9,68.39 C2.1 R11.2 192.53,69.53 192.53,70.99 191.77,71.75 185.29,71.75 184.15,70.61 v179.58,70.61 179.58,72.7 C3.1 179.45,72.83 179.45,74.67 179.25,74.86 | R17.1 v175.13,49.15 175.13,41.66 174.37,40.89 | L1.2 188.72,40.64 | 188.72,40.64 187.83,39.75 175.51,39.75 174.37,40.89 | U7.3 194.22,21.91 188.09,21.91 C19.2 | 187.89,21.65 188.09,21.84 188.03,21.84 C19.2 | U8.1 166.12,95.89 167.26,94.74 168.71,94.74 C14.+ 168.91,94.87 168.82,94.86 175.2,94.86 v175.39,94.87 175.39,78.74 175.5,78.61 179.25,74.86 | v196.09,99.82 199.01,102.87 205.1,102.87 206.5,101.6 206.5,98.93 | C1.1 194.19,18.96 U7.3 | R12.2 R9.2 208.28,95.95 208.28,97.16 206.5,98.93 | 206.5,98.89 206.5,98.93 | U1.5 198.07,62.69 195.39,60.01 195.26,60.01 | U1.17 198.66,53.95 197.61,54.99 197.61,57.66 195.26,60.01 | 174.37,40.89 169.65,40.89 M1.VCC | C19.2 167.83,21.65 161.29,28.19 v161.29,38.1 | D8.C 206.25,42.42 190.88,42.42 190.25,41.78 188.79,41.78 L1.2 | v191.64,41.27 191.13,40.64 188.72,40.64 | U9.8 208.09,15.49 C22.1 | 208.09,15.62 U9.8 | U7.3 JP20.1 198.12,16.76 199.39,15.49 200.6,15.49 R10.2 R19.2 208.03,15.43 U9.8 | v180.34,76.2 180.34,75.95 179.25,74.86
  Bottom 0.5: U1.38 189.98,61.46 | M1.VCC2 118.17,38.05 v118.11,38.1 | v161.29,38.1 161.29,38.99 162.94,40.64 169.28,40.64 | 169.29,40.64 169.28,40.64 | 169.28,40.64 M1.VCC
+12IN
  Bottom 1.016: X2.P$2 190.58,111.42 187.96,114.05 158.75,114.05 156.72,112.01 D5.A
+12V  (via drill 0.6, 1.2 pad 1.78)
  Top 1.016: v306.2,74.93 v294,74.93 v256.54,74.93 v249.94,74.93 v242.57,74.93 | v130.68,77.47 v139.19,77.47 168.91,77.47 v182.88,91.44
  Bottom 0.406: C4.1 169.84,100.63 170.56,101.35 171.21,101.35 U8.8 | C12.+ 246.89,74.93 246.92,74.9 249.84,74.9 v249.94,74.93 | v294,74.93 290.74,74.93 | 290.7,74.93 290.74,74.93 | 290.74,74.93 290.83,74.84 C13.+ | C5.1 194.86,93.14 194.82,93.09 | v139.19,77.47 140.72,75.95 143.21,75.95 C11.+
  Bottom 0.61: 130.56,67.44 130.68,67.56 | U2.15 260.73,57.78 261.11,57.4 261.11,56.77 260.86,56.52 U2.16 | U4.15 302.89,63.63 303.15,63.37 303.91,63.37 304.17,63.63 U4.16 | U3.15 129.29,64.14 129.03,64.39 129.03,65.15 129.29,65.41 U3.16
  Bottom 1.016: U4.16 305.21,65.56 306.2,66.55 v306.2,74.93 | v256.54,74.93 256.54,54.86 257.3,54.1 258.57,54.1 259.21,54.74 259.21,56.49 U2.16 | v242.57,74.93 242.57,82.04 233.3,91.31 197.61,91.31 195.83,93.09 194.82,93.09 184.53,93.09 v182.88,91.44 180.85,89.41 178.82,89.41 C10.+ 178.82,95.76 174.88,99.69 | v130.68,77.47 130.68,67.56 130.68,65.41 U3.16 | L3.1 177.8,105.09 C20.1 176.4,107.95 174.88,106.43 174.88,99.69 | 174.88,99.69 174.62,99.69 173.48,98.55 169.95,98.55 C4.1
+12VF  (via drill 1.2 pad 1.78)
  Bottom 0.406: 183.68,97.92 F1.2 183.64,97.16 185.67,95.12 190.63,95.12 193.04,97.54 v193.04,99.06
  Bottom 1.016: 178.69,100.02 C21.1 | C21.1 178.63,102.62 L3.2 | F1.2 179.54,97.95 178.56,98.93 178.56,100.01 C21.1
A  (via drill 0.6)
  Top 1.016: v350.14,104.39 v259.95,104.39 235.97,104.39 226.69,113.79 150.24,113.79 148.34,111.89 142.95,111.89 D3.P$7 | v140.34,106.43 v120.52,106.43 v50.08,106.43
  Bottom 0.406: 350.14,114.47 D1.P$7
  Bottom 0.61: R6.2 121.79,62.36 120.52,63.63 v120.52,106.43
  Bottom 1.016: v350.14,104.39 350.14,114.47 | D2.P$7 v259.95,104.39 | v50.08,106.43 D4.P$7 | D3.P$7 v140.34,106.43
A'
  Bottom 0.61: U3.13 127.25,61.59 126.49,62.36 R6.1
AREF
  Bottom 0.305: U1.29 189.36,53.95 189.36,50.04 185.42,46.1 C8.2 R17.2 R18.2
  Bottom 0.406: 180.59,52.07 R18.2 180.59,52.26
B  (via drill 0.6)
  Top 0.406: 355.22,114.6 D1.P$6
  Top 1.016: v55.16,104.39 v123.44,104.39 v145.41,104.39 | 355.22,114.6 355.22,111 350.77,106.55 v265.03,106.55 237.36,106.55 228.22,115.7 146.56,115.7 145.36,114.5 D3.P$6
  Bottom 0.406: 123.38,104.33 v123.44,104.39
  Bottom 0.61: R5.2 123.38,104.33
  Bottom 1.016: D2.P$6 v265.03,106.55 | v55.16,104.39 D4.P$6 | D3.P$6 v145.41,104.39
B'
  Bottom 0.61: U3.14 129.29,62.87 126.62,65.53 R5.1
C  (via drill 0.6 pad 0.61)
  Top 1.016: v50.08,15.88 v140.34,15.88 189.48,15.88 196.09,9.27 208.03,9.27 214.63,15.88 v259.95,15.88 v271.78,15.88 346.07,15.88 350.14,11.81 350.14,7.52 D1.P$4
  Bottom 0.61: R3.2 269.24,62.61 271.78,60.07 v271.78,15.88
  Bottom 1.016: D2.P$4 v259.95,15.88 | v50.08,15.88 D4.P$4 | v140.34,15.88 D3.P$4
C'
  Bottom 0.61: U2.12 261.62,61.59 262.64,62.61 R3.1
D  (via drill 0.6 pad 0.61)
  Top 1.016: v39.88,13.84 v130.18,13.84 189.23,13.84 195.45,7.62 208.91,7.62 215.26,13.97 v249.79,13.97 v269.11,13.97 336.8,13.97 339.98,10.79 339.98,7.52 D1.P$2
  Bottom 0.61: R2.2 267.72,59.56 269.11,58.17 v269.11,13.97
  Bottom 1.016: D2.P$2 v249.79,13.97 | v130.18,13.84 D3.P$2 | v39.88,13.84 39.88,7.54 D4.P$2
D'
  Bottom 0.61: U2.13 261.87,60.33 262.64,59.56 R2.1
DCF77  (via drill 0.6)
  Top 0.406: v192.79,54.23 185.93,60.96 185.93,89.03 189.48,92.58 203.33,92.58 v204.22,93.47
  Bottom 0.305: U1.26 192.91,54.12 v192.79,54.23
  Bottom 0.406: R12.1 206.38,93.47 v204.22,93.47 199.64,93.47 198.56,94.53 198.56,98.68 X4.3
DP  (via drill 0.6 pad 0.61)
  Top 1.016: v55.12,17.65 v145.41,17.65 190.12,17.65 196.85,11.05 207.52,11.05 214,17.65 v265.03,17.65 v274.57,17.65 351.79,17.65 354.96,14.48 354.96,7.74 D1.P$5
  Bottom 0.406: 355.09,7.6 D1.P$5
  Bottom 0.61: R4.2 270.13,65.66 274.57,61.21 v274.57,17.65
  Bottom 1.016: D2.P$5 v265.03,17.65 | v145.41,17.65 D3.P$5 | v55.12,17.65 55.12,7.54 D4.P$5
DP'
  Bottom 0.61: U2.11 261.31,62.87 R4.1
E  (via drill 0.6 pad 0.61)
  Top 1.016: D4.P$1 34.8,7.54 34.8,10.41 36.7,12.32 v125.09,12.32 188.47,12.32 194.69,6.1 209.8,6.1 215.9,12.19 v244.6,12.19 v267.33,12.19 330.19,12.19 D1.P$1
  Bottom 0.406: D2.P$1 244.6,7.47
  Bottom 0.61: R1.2 265.89,19.86 267.33,18.41 v267.33,12.19
  Bottom 1.016: 244.6,7.47 v244.6,12.19 | v125.09,12.32 D3.P$1
E'
  Bottom 0.61: U2.14 260.76,59.05 R1.1
F  (via drill 0.6, 0.6 pad 0.61)
  Top 1.016: v39.92,108.46 v117.35,108.46 v130.18,108.46 | v339.85,108.46 v249.79,108.46 239.01,108.46 229.87,117.6 133.35,117.6 130.25,114.5 D3.P$9
  Bottom 0.406: 339.85,114.47 D1.P$9 | 117.35,108.33 v117.35,108.46
  Bottom 0.61: R7.2 120.14,59.56 117.35,62.36 117.35,108.33
  Bottom 1.016: v339.85,108.46 339.85,114.47 | D2.P$9 v249.79,108.46 | v39.92,108.46 D4.P$9 | D3.P$9 v130.18,108.46
F'
  Bottom 0.61: U3.12 127.25,60.33 126.49,59.56 R7.1
G  (via drill 0.6, 0.6 pad 0.61)
  Top 1.016: v121.28,110.49 v114.81,110.49 38.9,110.49 D4.P$10 | v334.9,110.49 v244.71,110.49 240.41,110.49 231.39,119.51 130.1,119.51 D3.P$10
  Bottom 0.406: 334.9,114.47 D1.P$10 | 114.81,110.36 v114.81,110.49
  Bottom 0.61: R8.2 118.87,56.39 114.81,60.45 114.81,110.36
  Bottom 1.016: v334.9,110.49 334.9,114.47 | D2.P$10 v244.71,110.49 | D3.P$10 v121.28,110.49
G'
  Bottom 0.61: U3.11 129.29,59.05 126.62,56.39 R8.1
GND  (via drill 0.6, 1.2 pad 1.78)
  Bottom 0.254: 214.68,103.76 216.03,103.76 216.53,104.27 | 213.61,106.3 216.03,106.3 | U6.25 213.11,106.3
  Bottom 0.305: 213.61,106.3 213.11,106.3 213.11,106.93 213.12,106.95 U6.26
  other vias: 182.88,81.28 169.42,62.87 171.96,61.21 177.67,61.21 147.45,64.9 234.06,60.33 234.82,57.78 267.72,64.14 267.72,61.09 264.16,57.66 299.08,71.63 301.75,71.63 304.04,67.94 192.66,61.47 188.09,62.1 181.61,41.15 176.53,47.88 182.75,48.77 197.61,59.82 192.02,56.52 205.61,58.29 203.96,64.26 193.29,49.15 189.87,48.26 203.84,96.14
  pour Bottom: 0,122.05 390.02,122.05 390.02,0 0,0
  pour Top: -0.01,122.09 -0.01,0.05 390.13,0.07 390.13,122.11
  pour Route2: 0,122 390,122 390,0 0,0
  pour Route3: 0,122 390,122 390,0 0,0
HR1  (via drill 0.6)
  Top 1.016: v300.36,93.34 233.17,93.34 222.88,103.63 192.41,103.63 190.37,101.6 v135.25,101.6
  Bottom 0.61: U4.12 299.08,68.45
  Bottom 0.813: 299.08,68.45 300.36,69.72
  Bottom 1.016: 300.36,69.72 v300.36,93.34 | D3.P$3 v135.25,101.6 D3.P$8
HR10  (via drill 0.6)
  Top 1.016: v292.61,95.63 234.44,95.63 224.41,105.79 191.39,105.79 189.1,103.5 154.18,103.5 149.48,108.2 142.88,108.2 140.59,110.36 124.71,110.36 122.43,112.78 61.47,112.78 57.15,117.09 47.49,117.09 D4.P$8
  Bottom 0.61: 297.81,67.56 U4.11
  Bottom 1.016: v292.61,95.63 292.61,79.63 297.81,74.42 297.81,67.56 | D4.P$8 D4.P$3
M1
  Bottom 0.406: 344.79,61.72 345.04,61.47
  Bottom 0.61: U4.13 300.36,63.63
  Bottom 0.813: 300.36,63.63 302.26,61.72
  Bottom 1.016: D1.P$8 345.04,61.47 D1.P$3 | 302.26,61.72 344.79,61.72
M10  (via drill 0.6)
  Top 1.016: v303.15,101.35 v254.87,101.35
  Bottom 0.406: U4.14 301.62,65.81
  Bottom 0.61: 301.62,65.81 301.62,68.2
  Bottom 0.813: 301.62,68.2 303.15,69.85
  Bottom 1.016: D2.P$8 v254.87,101.35 D2.P$3 | 303.15,69.85 v303.15,101.35
MIN1  (via drill 0.6)
  Top 0.61: v213.49,49.91 v301.62,49.91
  Bottom 0.406: 301.62,56.23 U4.3 | R16.2 v213.49,49.91 | 204.93,49.91 U1.15
  Bottom 0.61: 204.93,49.91 v213.49,49.91 | v301.62,49.91 301.62,56.23
MIN10  (via drill 0.6, 0.7)
  Top 0.61: v217.81,51.56 v304.17,51.56
  Bottom 0.406: R15.2 v217.81,51.56 | 204.41,51.56 U1.14
  Bottom 0.61: 204.41,51.56 v217.81,51.56 | v304.17,51.56 U4.1
MISO_SEG_D  (via drill 0.6)
  Top 0.406: v207.19,71.75 207.19,81.99 202.86,86.32 X1.1
  Bottom 0.406: 198.63,65.53 197.54,65.53 U1.2
  Bottom 0.5: v207.19,71.75 204.85,71.75 198.63,65.53
  Bottom 0.61: v207.19,71.75 220.6,71.75 233.3,59.05 U2.3
MOSI_SEG_C  (via drill 0.6)
  Top 0.406: X1.4 195,88.84 196.34,87.5 196.34,84.45 204.28,76.52 v204.28,72.71
  Bottom 0.5: 198.25,66.67 197.55,66.67 U1.1
  Bottom 0.61: 198.25,66.67 v204.28,72.71 204.98,73.41 220.85,73.41 232.79,61.59 U2.5
N$1
  Bottom 0.406: Q1.2 C6.2 204.39,66.74 200.53,62.87 200.4,62.74 U1.7
N$2
  Bottom 0.406: U1.8 201.34,62.55 C7.2 208.98,62.55 211.46,60.07 211.46,57.16 Q1.1
N$3
  Bottom 0.406: R9.1 206.44,97.34 205.74,98.04 205.74,100.84 204.47,102.11 201.68,102.11 200.91,101.35 200.94,100.33 X4.1
N$4
  Bottom 1.016: F1.1 188.72,100.97 189.74,101.98 189.74,106.3 184.02,112.01 165.86,112.01 159.13,105.28 156.76,105.28 D5.C
N$5
  Bottom 0.406: R20.2 204.92,45.66 203.2,43.94 195.45,43.94 193.8,45.59 193.8,46.93 D6.A
N$6
  Top 0.406: D6.K 196.22,47.05 196.22,50.55 194.06,52.7 194.06,72.26 193.68,72.64 193.68,74.94 D7.A
N$7
  Bottom 0.406: R21.1 T1.1
N$8
  Bottom 0.406: D8.A 210.19,39.37 T1.3 210.19,39.07 210.19,35.31 208.53,33.66 201.29,33.66 199.95,35 SG2.-
N$11
  Bottom 0.406: C9.1 188.47,44 L1.1 188.72,48.51 190,49.8 190,52.34 U1.27
N$12
  Bottom 0.406: U6.17 211,101.1 C15.2
N$16
  Bottom 0.406: L2.1 213.32,103.05 U6.20 216.34,103.05 217.68,104.39 217.68,108.2 218.88,109.41 C18.2 219.01,110.49 223.01,110.49 224.03,109.47 224.03,107.19 223.14,106.3 U6.4
PA0  (via drill 0.6)
  Top 0.305: v195.45,57.4 205.74,47.12 JP8.1
  Bottom 0.305: v195.45,57.4 193.67,59.31 191.01,59.31 189.36,60.96 U1.37
PA1  (via drill 0.6)
  Top 0.305: v196.34,54.86 204.85,46.35 204.85,31.88 203.2,30.23 JP7.1
  Bottom 0.305: v196.34,54.86 192.66,58.55 190.76,58.55 U1.36
PA2  (via drill 0.6)
  Top 0.305: v195.33,53.72 198.5,50.55 198.5,47.5 197.99,46.99 197.99,38.61 200.03,36.58 200.03,33.53 199.39,32.89 199.39,26.67 JP6.1
  Bottom 0.305: v195.33,53.72 194.56,54.48 194.56,55.24 192.02,57.78 190.26,57.78 U1.35
PA3  (via drill 0.6)
  Top 0.305: v185.67,56.13 188.98,52.83 188.98,35.18 194.44,29.59 194.44,26.54 JP5.1
  Bottom 0.406: U1.34 187.18,58.78 187.2,57.78 v185.67,56.13
PA4  (via drill 0.6)
  Top 0.305: v184.15,54.23 184.15,30.73 186.94,27.94 JP4.1
  Bottom 0.406: U1.33 185.15,54.21 v184.15,54.23
PA5  (via drill 0.6)
  Top 0.305: v185.67,50.29 185.67,35.31 191.77,29.08 191.77,26.67 JP2.1
  Bottom 0.406: U1.32 185.67,53.59 v185.67,50.29
PA6  (via drill 0.6)
  Top 0.305: v187.2,51.56 187.2,35.69 189.36,33.4 191.13,31.5 193.04,29.59 JP1.1
  Bottom 0.406: U1.31 187.19,53.97 v187.2,51.56
PA7  (via drill 0.6)
  Top 0.305: v183.01,47.12 183.01,28.57 186.18,25.4 JP3.1
  Bottom 0.406: U1.30 188.47,54.2 188.47,50.42 185.17,47.12 v183.01,47.12
PC2  (via drill 0.6)
  Top 0.406: v200.03,46.23 201.93,44.32 v201.93,40.01
  Bottom 0.406: U1.21 199.39,48.66 199.39,46.86 v200.03,46.23 | R21.2 204.98,40.01 v201.93,40.01
PC3  (via drill 0.6)
  Top 0.305: v199.26,45.21 200.66,43.81 JP12.1
  Bottom 0.406: v199.26,45.21 198.5,45.97 198.5,48.39 195.83,51.06 U1.22
PC4  (via drill 0.6)
  Top 0.305: v194.94,49.66 194.94,45.72 196.09,44.58 196.09,34.54 198.12,32.51 JP11.1
  Bottom 0.406: 193.28,51.07 U1.23 193.51,51.09 v194.94,49.66
PC5  (via drill 0.6)
  Top 0.305: v191.77,46.74 195.07,43.43 195.07,32.64 196.85,30.86 196.85,26.92 198.12,25.65 JP10.1
  Bottom 0.305: 192.72,51.62 U1.24
  Bottom 0.406: v191.77,46.74 191.77,50.67 192.72,51.62
PC6  (via drill 0.6)
  Top 0.305: v190.25,46.86 190.25,45.97 194.18,42.16 194.18,32.13 195.58,30.73 195.58,27.18 196.85,25.91 196.85,23.88 196.09,23.11 191.52,23.11 190.63,22.23 190.63,22.15 U7.1
  Bottom 0.305: 192.15,52.2 U1.25
  Bottom 0.406: v190.25,46.86 191.01,47.62 191.01,51.05 192.15,52.2
PD7
  Bottom 0.406: 205.04,47.5 R20.1 205.1,48.6 U1.16
RESET  (via drill 0.6)
  Top 0.406: v188.85,69.47 v188.85,74.8 188.85,82.71 X1.5 | v200.28,64.01 200.28,67.94 v196.09,72.14
  Bottom 0.406: X1.5 192.53,86.25 192.53,84.2 193.29,83.44 205.7,83.44 S1.1 S1.2 | v188.85,69.47 190.5,69.47 190.75,69.41 R11.1 | U1.4 198.28,64.01 v200.28,64.01 | v196.09,72.14 195.2,73.03 190.63,73.03 v188.85,74.8
RX-µC  (via drill 0.6)
  Top 0.406: v204.34,61.21 219.71,76.58 v219.71,93.85
  Bottom 0.406: U6.1 220.52,108.25 219.71,107.44 v219.71,93.85 | U1.9 200.38,60.42 201.17,61.21 v204.34,61.21
SCK_SEG_E  (via drill 0.6)
  Top 0.406: v205.74,69.34 204.6,69.34 203.07,70.87 203.07,76.33 195,84.4 X1.3
  Bottom 0.406: 199.26,64.77 197.91,64.77 U1.3
  Bottom 0.5: v205.74,69.34 203.84,69.34 199.26,64.77
  Bottom 0.61: U2.1 234.06,56.52 219.96,70.61 207.77,70.61 206.5,69.34 v205.74,69.34
SCL  (via drill 0.6)
  Top 0.406: v203.2,45.72 203.84,45.09 203.84,36.45 v203.78,35.51
  Bottom 0.406: v203.2,45.72 203.2,47.24 U1.19 | v203.78,35.51 201.6,35.51 199.9,37.21 176.15,37.21 174.37,35.43 171.83,35.43 171.7,35.31 M1.SCL 169.26,35.43 163.96,35.43 163.07,34.54 163.07,29.46 167.26,25.27 183.64,25.27 184.78,24.13 189.1,24.13 189.74,23.5 202.18,23.5 203.2,22.48 JP19.1 R19.1 205.17,17.33 206.25,18.41 208.79,18.41 209.55,19.18 U9.2
SDA  (via drill 0.6)
  Top 0.406: v202.89,38.05 202.89,44.51 200.91,46.48 v200.91,47.12 | JP18.1 200.66,21.72 201.55,22.61 206.88,22.61 v208.15,23.88
  Bottom 0.406: v200.91,47.12 200.91,48.27 U1.20 | v202.89,38.05 M1.SDA 169.26,37.97 163.7,37.97 162.18,36.45 162.18,28.83 167.77,23.24 188.85,23.24 189.48,22.61 199.9,22.61 200.66,21.84 JP18.1 R10.1 | v208.15,23.88 U9.1
SEG_A
  Bottom 0.5: 178.82,64.14 179.96,65.28 190.69,65.28 U1.42
  Bottom 0.61: U3.3 147.45,62.87 148.72,64.14 178.82,64.14
SEG_B
  Bottom 0.5: 190.93,66.17 U1.43
  Bottom 0.61: U3.1 143.89,65.41 144.65,66.17 190.93,66.17
SEG_DP  (via drill 0.6)
  Top 0.406: v259.33,68.07 232.16,68.07 v224.16,76.07 | v216.03,76.07 207.26,67.44 203.96,67.44 198.25,73.15 198.25,76.2 197.23,77.22 192.28,77.22 191.26,76.2 191.26,68.2 v192.53,66.93
  Bottom 0.406: U2.9 259.24,67.97 v259.33,68.07 | v216.03,76.07 v224.16,76.07 | v192.53,66.93 192.53,65.79 192.52,65.8 U1.44
SEG_F
  Bottom 0.5: 179.2,62.61 180.72,64.26 190.58,64.26 U1.41
  Bottom 0.61: U3.5 168.78,60.33 171.07,62.61 179.2,62.61
SEG_G  (via drill 0.6)
  Top 0.61: v130.81,53.09 v140.08,53.09
  Bottom 0.406: 130.78,53.11 v130.81,53.09
  Bottom 0.5: 181.86,63.37 190.33,63.37 U1.40
  Bottom 0.61: U3.9 130.78,53.11 | v140.08,53.09 145.41,53.09 149.86,57.53 176.02,57.53 181.86,63.37
STD1  (via drill 0.6)
  Top 0.61: v222.25,53.21 v291.72,53.21
  Bottom 0.406: 299.08,56.23 U4.5 | R14.2 v222.25,53.21 | U1.13 200.92,56.14 200.97,56.13
  Bottom 0.5: 200.97,56.13 203.89,53.21
  Bottom 0.61: 203.89,53.21 v222.25,53.21 | 299.08,56.23 299.08,54.36 297.94,53.21 v291.72,53.21
STD10  (via drill 0.6)
  Top 0.61: v203.2,56.39 v226.57,56.39 v291.59,56.39
  Bottom 0.406: R13.2 v226.57,56.39 | 295.27,65.53 U4.9 | 201.46,56.77 U1.12
  Bottom 0.5: 201.46,56.77 201.84,56.39 v203.2,56.39
  Bottom 0.61: v291.59,56.39 291.59,63.5 293.62,65.53 295.27,65.53
TX-µC  (via drill 0.6)
  Top 0.406: v224.28,96.77 224.28,78.36 205.61,59.69 v204.34,59.69
  Bottom 0.406: U6.5 222.77,105.65 224.28,104.14 v224.28,96.77 | 200.92,59.82 U1.10 201.51,60.45 203.58,60.45 v204.34,59.69
USBM
  Bottom 0.406: C17.2 215.83,97.47 216.66,98.3 216.66,100.08 216.29,100.45 U6.16 212.72,100.45 211.84,99.57 209.8,99.57 209.04,100.33 209.04,103.38 206.25,106.17 201.44,106.17 X3.D-
USBP
  Bottom 0.406: U6.15 213.53,99.8 C16.2 209.87,97.47 208.28,99.06 208.28,102.87 205.99,105.16 199.9,105.16 197.61,107.44 197.61,109.09 X3.D+

### Text on the board
Top: 8. | 8. | 8. | 8.
Bottom: Kaunis Kello / Version 4.0 Big / / M. Langner / B. Redemann / 2015-2016
bPlace: 12Vin | 12V | GND | 5V | Ports | I2C-Bus